# EAGLE design shutoff (EAGLE 9.5.0)
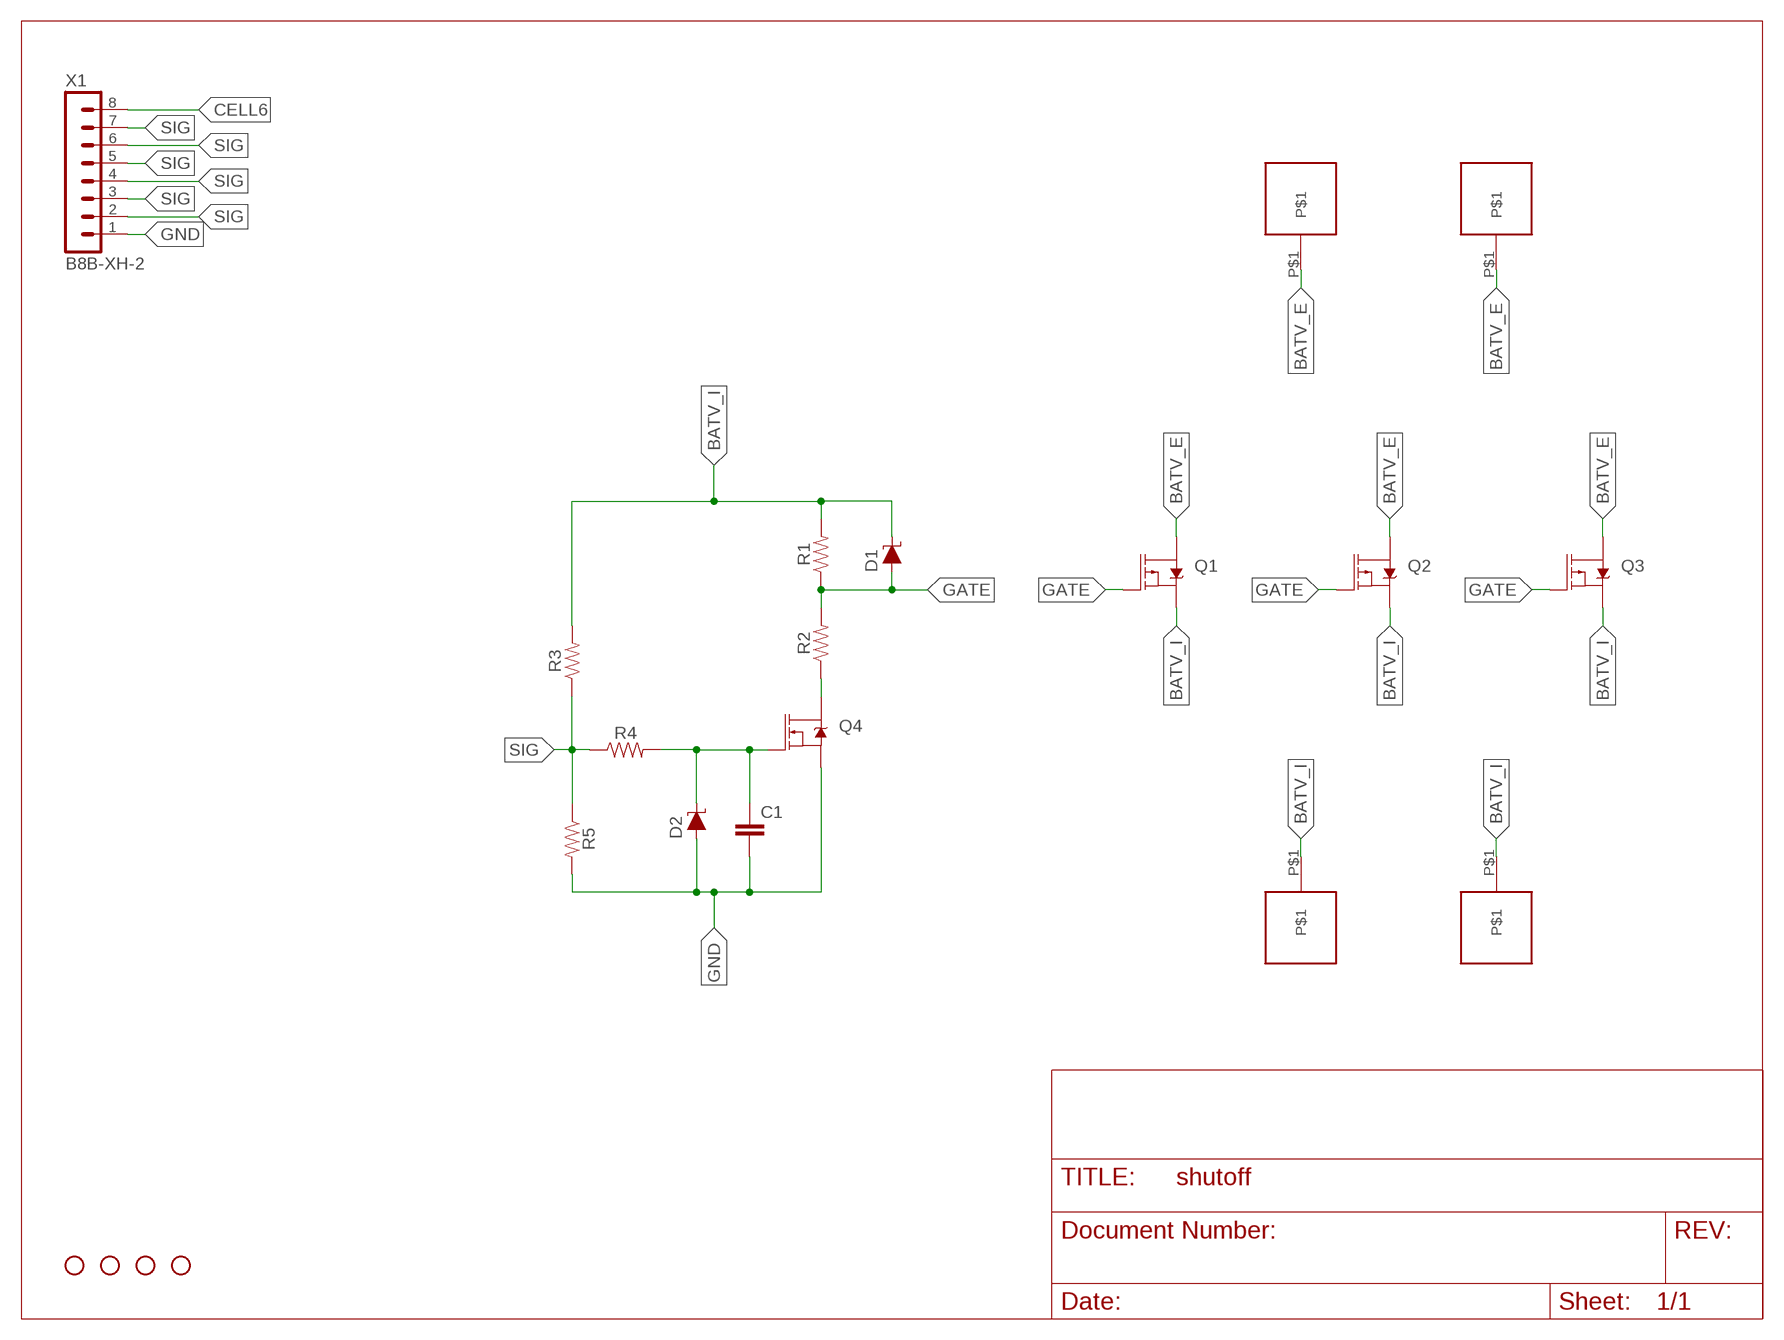
[diagram p0: schematic, sheet 1]

## Parts
C1  CAPACITOR_0805  [0805]
D1  DIODE_TVS_DO-214AA  [DO214AA]
D2  DIODE_TVS_DO-214AA  [DO214AA]
H1  STAND-OFF  [STAND-OFF]
H2  STAND-OFF  [STAND-OFF]
H3  STAND-OFF  [STAND-OFF]
H4  STAND-OFF  [STAND-OFF]
Q1  MOSFET_PMOS_TO-263  [TO-263/D2PAK]
Q2  MOSFET_PMOS_TO-263  [TO-263/D2PAK]
Q3  MOSFET_PMOS_TO-263  [TO-263/D2PAK]
Q4  MOSFET_NMOS_TO-263  [TO-263/D2PAK]
R1  RESISTOR_0805  [0805]
R2  RESISTOR_0805  [0805]
R3  RESISTOR_0805  [0805]
R4  RESISTOR_0805  [0805]
R5  RESISTOR_0805  [0805]
W1  16G  [16G]
W2  16G  [16G]
W3  16G  [16G]
W4  16G  [16G]
X1  B8B-XH-2  [B8B-XH-A]

## Nets
BATV_E: Q1.2(D) Q2.2(D) Q3.2(D) W1.P$1 W2.P$1
BATV_I: D1.C Q1.3(S) Q2.3(S) Q3.3(S) R1.2 R3.2 W3.P$1 W4.P$1
CELL6: X1.8
GATE: D1.A Q1.1(G) Q2.1(G) Q3.1(G) R1.1 R2.2
GND: C1.2 D2.A Q4.3(S) R5.2 X1.1
N$3: Q4.2(D) R2.1
N$4: C1.1 D2.C Q4.1(G) R4.2
SIG: R3.1 R4.1 R5.1 X1.2 X1.3 X1.4 X1.5 X1.6 X1.7

## Library data of the parts
C1 = EcoCar-Passives:CAPACITOR_0805
D1 D2 = EcoCar-Fuses-Protection:DIODE_TVS_DO-214AA
H1-H4 = EcoCar-Miscellaneous:STAND-OFF: Stand Off Drill holes for mechanically mounting via screws, standoffs, etc. Note: Use the keepout ring to avoid running the screw head into surrounding components. Variant Overviews STAND-OFF - Mechanical footprint for a #4 phillips button head screw. STAND-OFF-TIGHT - Mechanical footprint for a #4 phillips button head screw, Example SparkFun Products Screw - Phillips Head (1/4", 4-40, 10 pack) <https://www.sparkfun.com/products/10453> (PRT-10453) Screw - Phillips Head (1/2", 4-40, 10 pack) <https://www.sparkfun.com/products/10452> (PRT-10452) Screw - Phillips Head (3/4", 4-40, 10 pack) <https://www.sparkfun.com/products/10451> (PRT-10451) Screw - Phillips Head (1", 4-40, 10 pack) <https://www.sparkfun.com/products/10450> (PRT-10450)
Q1-Q3 = EcoCar-Discrete-Semiconductors:MOSFET_PMOS_TO-263
Q4 = EcoCar-Discrete-Semiconductors:MOSFET_NMOS_TO-263
R1-R5 = EcoCar-Passives:RESISTOR_0805
W1-W4 = Wire2Board:16G
X1 = con-JST:B8B-XH: JST XH series header 2.50mm pitch disconnectable crimp style connectors, vertical (side entry type), 8 pins

## Board
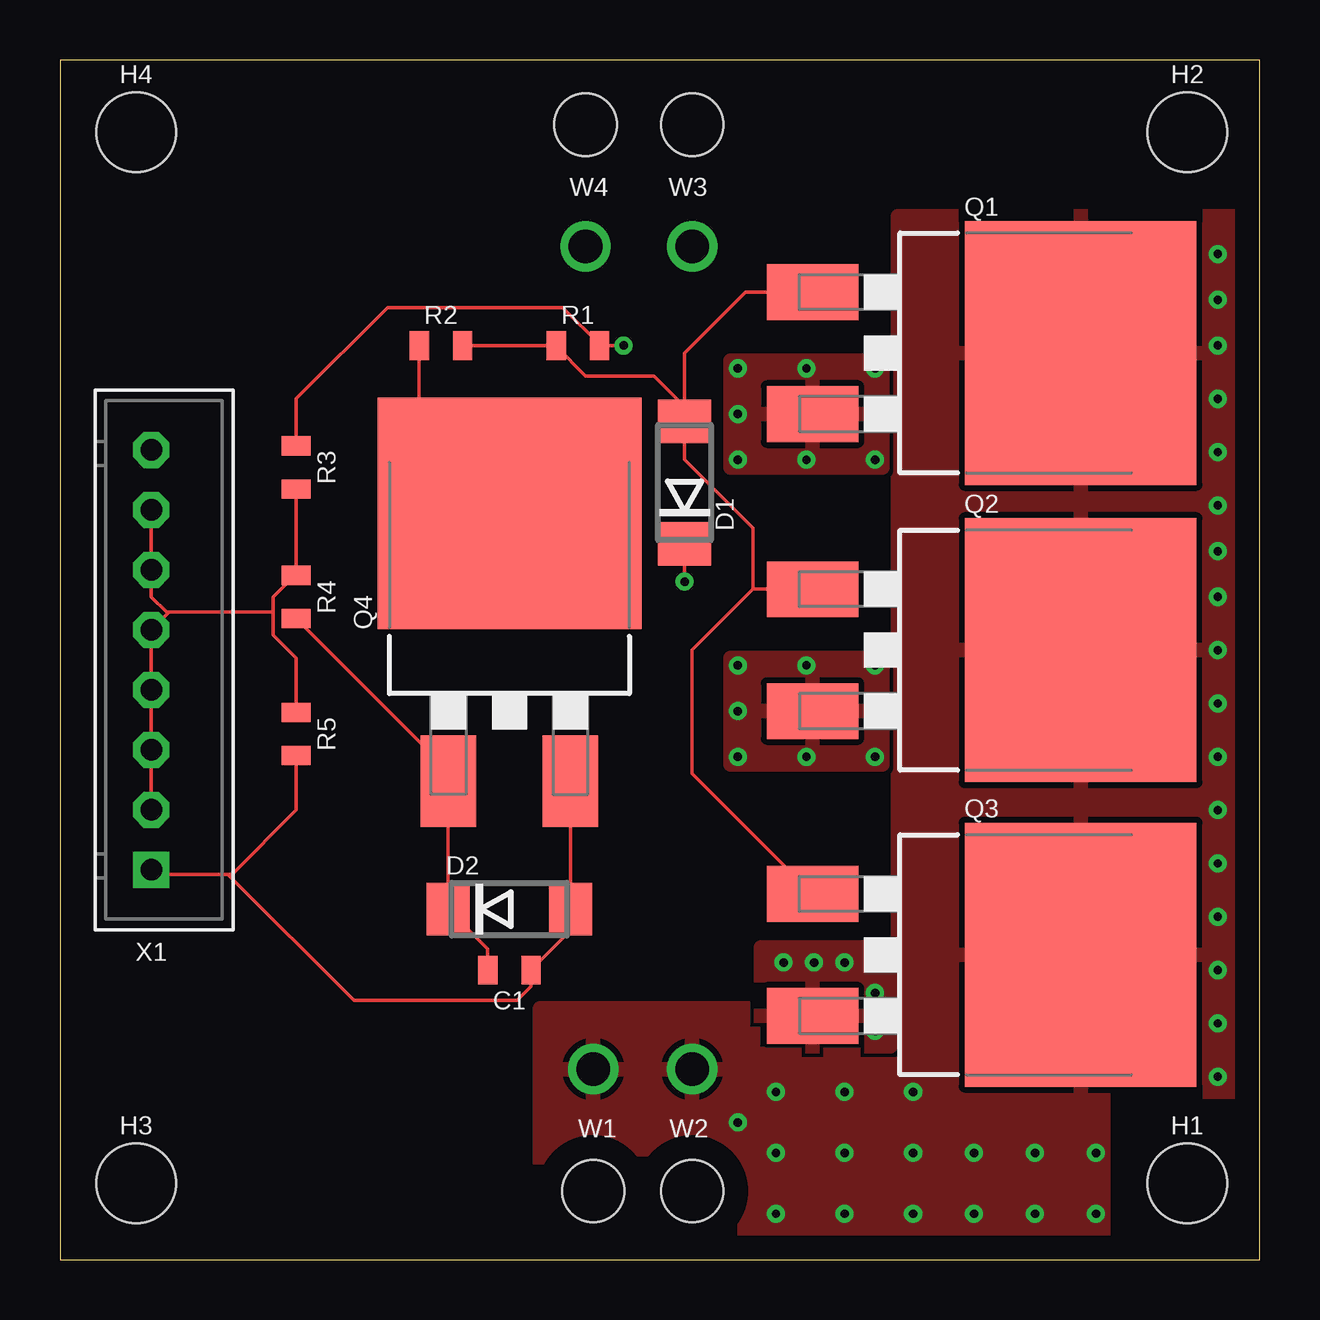
[diagram p1: board, top side]
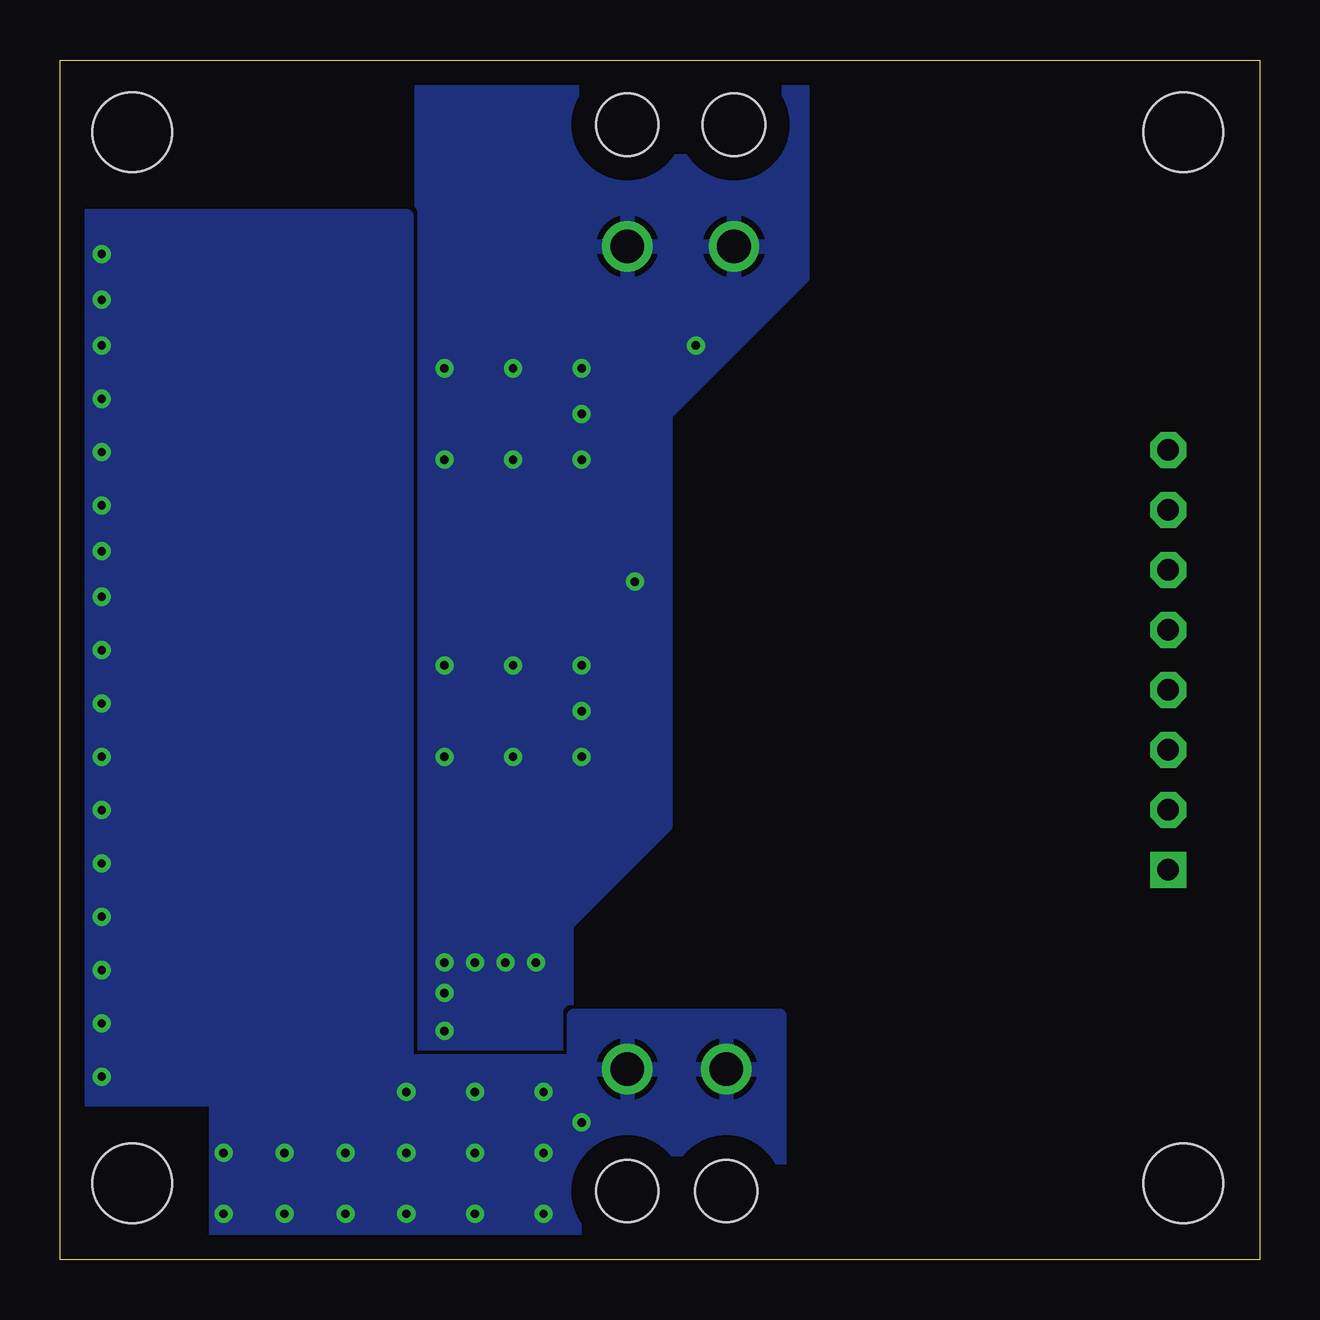
[diagram p2: board, bottom side, seen from below]

Size 50 x 50 mm. Coordinates in mm from the lower left corner, seen from the top.
Outline: 0,0 50,0 50,50 0,50 0,0
Copper layers (1*16): Top 0.035mm / dielectric 1.5mm / Bottom 0.035mm
Design rules "default": minimum track width 6mil, minimum drill 0.35mm, track to track 6mil, track to pad 6mil, pad to pad 6mil, via to via 6mil, smd to smd 6mil, copper to edge 40mil, drill to drill 6mil, minimum pad ring 10mil, minimum via ring 8mil, stop-mask expansion 4mil, vias tented up to drill 0mil, thermal gap 10mil

### Footprints (pad centres in the part's own frame; a part is rotated, then mirrored left to right if it is on the bottom)
0805 = smd 0.8 x 1.2: 1 -0.9,0; 2 0.9,0
DO214AA = smd 1.8 x 2.2: A 2.55,0; C -2.55,0
STAND-OFF = hole 3.302: 0,0
TO-263/D2PAK = smd 2.32 x 3.81: 1 -2.54,-7.045; 3 2.54,-7.045 | smd 11 x 9.65: 2 0,4.125
16G = drill 1.4: P$1 0,0 | hole 2.6: 5.08,0
B8B-XH-A = drill 0.9 pad 1.5 square: 1 8.75,0 | drill 0.9 pad 1.5 octagon: 2 6.25,0; 3 3.75,0; 4 1.25,0; 5 -1.25,0; 6 -3.75,0; 7 -6.25,0; 8 -8.75,0

### Placement (x,y rotation side)
C1  18.73,12.06 0 top
D1  26.04,32.38 90 top
D2  18.73,14.61 0 top
H1  46.99,3.17 0 top
H2  46.99,46.99 0 top
H3  3.17,3.17 0 top
H4  3.17,46.99 0 top
Q1  38.42,37.78 270 top
Q2  38.42,25.4 270 top
Q3  38.42,12.7 270 top
Q4  18.73,26.99 0 top
R1  21.59,38.1 0 top
R2  15.88,38.1 0 top
R3  9.84,33.02 90 top
R4  9.84,27.62 270 top
R5  9.84,21.91 270 top
W1  22.23,7.94 270 top
W2  26.35,7.94 270 top
W3  26.35,42.23 90 top
W4  21.91,42.23 90 top
X1  3.81,25 270 top

### Tracks (layer width: path | path; a pad name or v marks a point on that pad's centre or on a via)
BATV_E  (via drill 0.35)
  other vias: 29.84,6.99 29.84,4.45 29.84,1.91 32.7,1.91 32.7,4.45 32.7,6.99 35.56,6.99 35.56,4.45 35.56,1.91 28.26,5.71 38.1,4.45 38.1,1.91 40.64,1.91 40.64,4.45 43.18,1.91 43.18,4.45 48.26,7.62 48.26,9.84 48.26,12.06 48.26,14.29 48.26,16.51 48.26,18.73 48.26,20.95 48.26,23.18 48.26,25.4 48.26,27.62 48.26,29.53 48.26,31.43 48.26,33.66 48.26,35.88 48.26,38.1 48.26,40.01 48.26,41.91
  pour Top (rank 2): 20,10.16 20,0 22.23,0 43.5,0 43.5,6.99 49.53,6.99 49.53,9.21 49.53,43.5 43.5,43.5 34.92,43.5 34.92,36.83 34.92,8.57 32.7,8.57 28.89,8.57 28.89,10.48 20,10.48
  pour Bottom: 20,10.16 28.57,10.16 28.57,9.53 28.57,8.26 35.56,8.26 35.56,12.38 35.56,43.5 49.53,43.5 49.53,42.86 49.53,6.67 43.5,6.67 43.5,0.95 20,0.95
BATV_I  (via drill 0.35)
  Top 0.152: 31.37,35.17 Q1.3 | D1.C v26.04,28.26 | R1.2 22.54,38.1 | 22.54,38.1 v23.5,38.1 | R3.2 9.84,35.88 13.65,39.69 20.95,39.69 22.54,38.1
  other vias: 28.26,37.15 28.26,35.24 28.26,33.34 33.97,33.34 33.97,37.15 33.97,24.77 33.97,20.95 28.26,20.95 28.26,24.77 28.26,22.86 33.97,12.38 33.97,11.11 31.43,12.38 30.16,12.38 33.97,9.53 32.7,12.38 31.11,24.77 31.11,20.95 31.11,37.15 31.11,33.34
  pour Top: 34.29,20.64 34.29,25.08 32.38,25.08 27.94,25.08 27.94,23.18 27.94,20.64
  pour Top: 34.29,33.02 34.29,37.47 32.38,37.47 27.94,37.47 27.94,35.56 27.94,33.02
  pour Top: 34.61,8.89 34.61,13.02 29.21,13.02 29.21,8.89
  pour Bottom (rank 2): 28.89,8.57 34.92,8.57 34.92,49.85 19.05,49.85 19.05,40.96 24.77,35.24 24.77,18.1 28.89,18.1
  pour Bottom: 24.77,18.1 28.89,13.97 28.89,18.1
GATE
  Top 0.152: D1.A 26.04,35.56 24.77,36.83 21.91,36.83 20.69,38.05 R1.1 R2.2 | Q3.1 26.35,20.26 26.35,25.4 28.89,27.94 | 28.89,27.94 Q2.1 | D1.A 26.04,33.34 28.89,30.48 28.89,27.94 | D1.A 26.04,37.78 28.57,40.32 Q1.1
GND
  Top 0.152: X1.1 4,16.06 6.99,16.06 | Q4.3 21.28,19.93 D2.A 21.28,13.71 C1.2 19.63,11.38 19.05,10.79 12.25,10.79 6.99,16.06 | R5.2 9.84,18.73 7.17,16.06 6.99,16.06
N$3
  Top 0.152: R2.1 14.97,34.24 17.46,31.75 18.73,31.75 Q4.2
N$4
  Top 0.152: C1.1 17.83,12.96 D2.C Q4.1 16.19,20.37 R4.2
SIG
  Top 0.152: R4.1 9.84,28.57 | 9.84,28.57 R3.1 | R5.1 9.84,25.08 8.89,26.04 8.89,26.99 | 8.89,26.99 8.89,27.62 9.84,28.57 | 4.55,26.99 X1.5 X1.4 X1.3 X1.2 | 4.55,26.99 8.89,26.99 | 4.55,26.99 4.45,26.99 3.81,27.62 X1.6 X1.7